# EAGLE design programer (EAGLE 5.06)

## Sheet 1 of 2
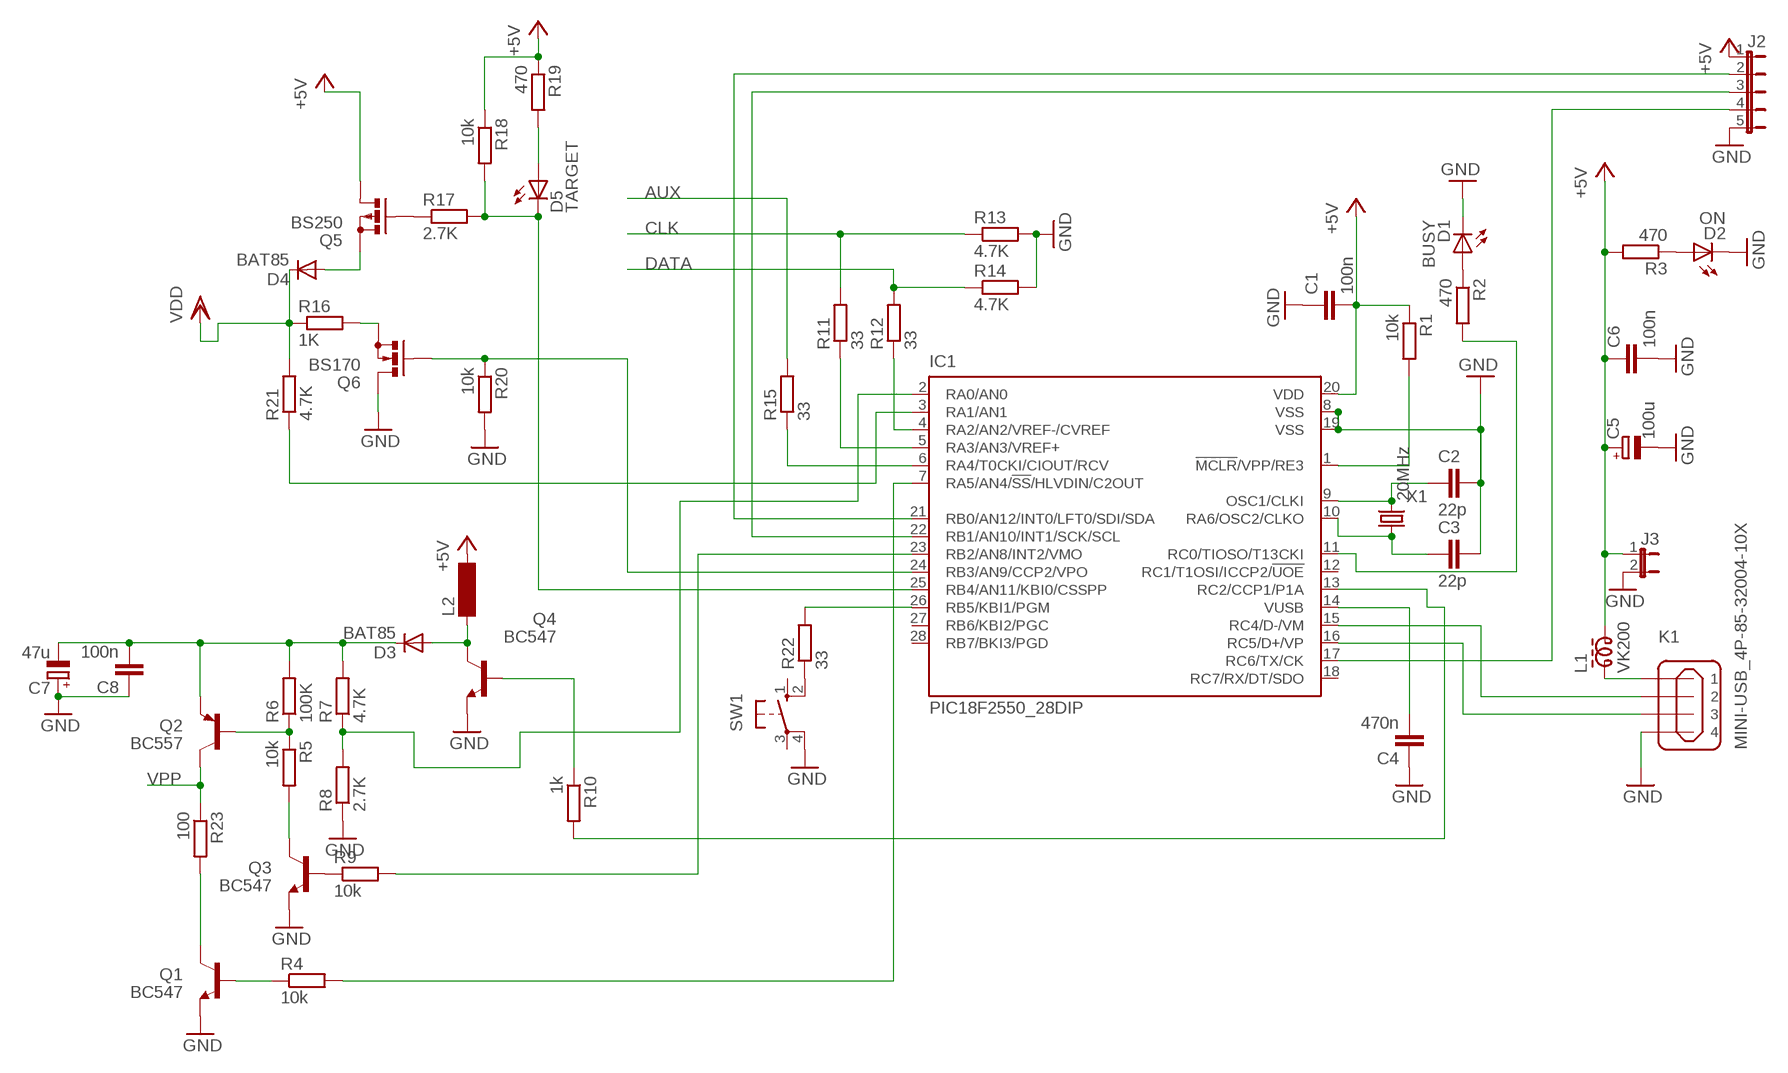
[diagram p0: schematic, sheet 1]

### Parts
C1  100n  C-EU025-025X050  [C025-025X050]
C2  22p  C-EU025-025X050  [C025-025X050]
C3  22p  C-EU025-025X050  [C025-025X050]
C4  470n  C-EU025-025X050  [C025-025X050]
C5  100u  CPOL-EUE2-4  [E2-4]
C6  100n  C-EU025-025X050  [C025-025X050]
C7  47u  CPOL-EUE2-4  [E2-4]
C8  100n  C-EU025-025X050  [C025-025X050]
D1  BUSY  LED3MM  [LED3MM]
D2  ON  LED3MM  [LED3MM]
D3  BAT85  BAT81  [DO34-7]
D4  BAT85  BAT81  [DO34-7]
D5  TARGET  LED3MM  [LED3MM]
IC1  PIC18F2550_28DIP  [DIL28-3]
J2  JP5L  [JP5L]
J3  JP1E  [JP1]
K1  MINI-USB_4P-85-32004-10X  [85-32004-10X]
L1  VK200  ZD60820511  [ZD6-2W]
L2  SD75  [SD75]
Q1  BC547  [TO92]
Q2  BC557  [TO92]
Q3  BC547  [TO92]
Q4  BC547  [TO92]
Q5  BS250  [SOT54E]
Q6  BS170  [SOT54E]
R1  10k  R-EU_0204/5  [0204/5]
R2  470  R-EU_0204/5  [0204/5]
R3  470  R-EU_0204/5  [0204/5]
R4  10k  R-EU_0204/5  [0204/5]
R5  10k  R-EU_0204/5  [0204/5]
R6  100K  R-EU_0204/5  [0204/5]
R7  4.7K  R-EU_0204/5  [0204/5]
R8  2.7K  R-EU_0204/5  [0204/5]
R9  10k  R-EU_0204/5  [0204/5]
R10  1k  R-EU_0204/5  [0204/5]
R11  33  R-EU_0204/5  [0204/5]
R12  33  R-EU_0204/5  [0204/5]
R13  4.7K  R-EU_0204/5  [0204/5]
R14  4.7K  R-EU_0204/5  [0204/5]
R15  33  R-EU_0204/5  [0204/5]
R16  1K  R-EU_0204/5  [0204/5]
R17  2.7K  R-EU_0204/5  [0204/5]
R18  10k  R-EU_0204/5  [0204/5]
R19  470  R-EU_0204/5  [0204/5]
R20  10k  R-EU_0204/5  [0204/5]
R21  4.7K  R-EU_0204/5  [0204/5]
R22  33  R-EU_0204/5  [0204/5]
R23  100  R-EU_0204/5  [0204/5]
SW1  10-XX  [B3F-10XX]
X1  20MHz  CRYSTALHC18U-V  [HC18U-V]

### Nets
+5V: C1.2 C5.+ C6.1 IC1.20(VDD) J2.1 J3.1 L1.2 L2.2 Q5.D R1.1 R3.2 R18.1 R19.1
AUX: R15.2 ; also sheet 2
CLK: R11.2 R13.1 ; also sheet 2
DATA: D5.K(C) IC1.25(RB4/AN11/KBI0/CSSPP) R12.2 R14.1 R17.2 R18.2 ; also sheet 2
GND: C1.1 C2.1 C3.1 C4.1 C5.- C6.2 C7.+ C8.1 D1.K(C) D2.K(C) IC1.8(VSS) IC1.19(VSS) J2.5 J3.2 K1.4 Q1.1(E) Q3.1(E) Q4.1(E) Q6.D R8.1 R13.2 R14.2 R20.2 SW1.4(P1) ; also sheet 2
K1: K1.1 L1.1
N$1: C4.2 IC1.14(VUSB)
N$2: D2.A R3.1
N$3: C2.2 IC1.9(OSC1/CLKI) X1.2
N$4: C3.2 IC1.10(RA6/OSC2/CLKO) X1.1
N$5: IC1.1(!MCLR!/VPP/RE3) R1.2
N$6: D1.A R2.1
N$7: IC1.11(RC0/TIOSO/T13CKI) R2.2
N$8: IC1.15(RC4/D-/VM) K1.2
N$9: IC1.16(RC5/D+/VP) K1.3
N$10: IC1.21(RB0/AN12/INT0/LFT0/SDI/SDA) J2.2
N$11: IC1.22(RB1/AN10/INT1/SCK/SCL) J2.3
N$12: IC1.17(RC6/TX/CK) J2.4
N$13: Q5.G R17.1
N$14: IC1.7(RA5/AN4/!SS!/HLVDIN/C2OUT) R4.2
N$15: Q4.2(B) R10.1
N$16: IC1.4(RA2/AN2/VREF-/CVREF) R12.1
N$17: IC1.5(RA3/AN3/VREF+) R11.1
N$18: IC1.6(RA4/T0CKI/CIOUT/RCV) R15.1
N$19: IC1.26(RB5/KBI1/PGM) R22.2
N$20: R22.1 SW1.2(S1)
N$21: IC1.13(RC2/CCP1/P1A) R10.2
N$22: D5.A R19.2
N$23: IC1.24(RB3/AN9/CCP2/VPO) Q6.G R20.1
N$24: Q6.S R16.2
N$25: D4.A Q5.S
N$26: IC1.3(RA1/AN1) R21.1
N$27: Q2.2(B) R5.1 R6.1
N$28: IC1.2(RA0/AN0) R7.1 R8.2
N$29: Q3.3(C) R5.2
N$30: D3.A L2.1 Q4.3(C)
N$31: C7.- C8.2 D3.C Q2.1(E) R6.2 R7.2
N$32: Q3.2(B) R9.1
N$33: Q1.2(B) R4.1
N$34: IC1.23(RB2/AN8/INT2/VMO) R9.2
N$35: Q1.3(C) R23.2
VDD: D4.C R16.1 R21.2 ; also sheet 2
VPP: Q2.3(C) R23.1 ; also sheet 2
Unconnected: IC1.12(RC1/T1OSI/ICCP2/!UOE) IC1.18(RC7/RX/DT/SDO) IC1.27(RB6/KBI2/PGC) IC1.28(RB7/BKI3/PGD) SW1.1(S) SW1.3(P)

## Sheet 2 of 2
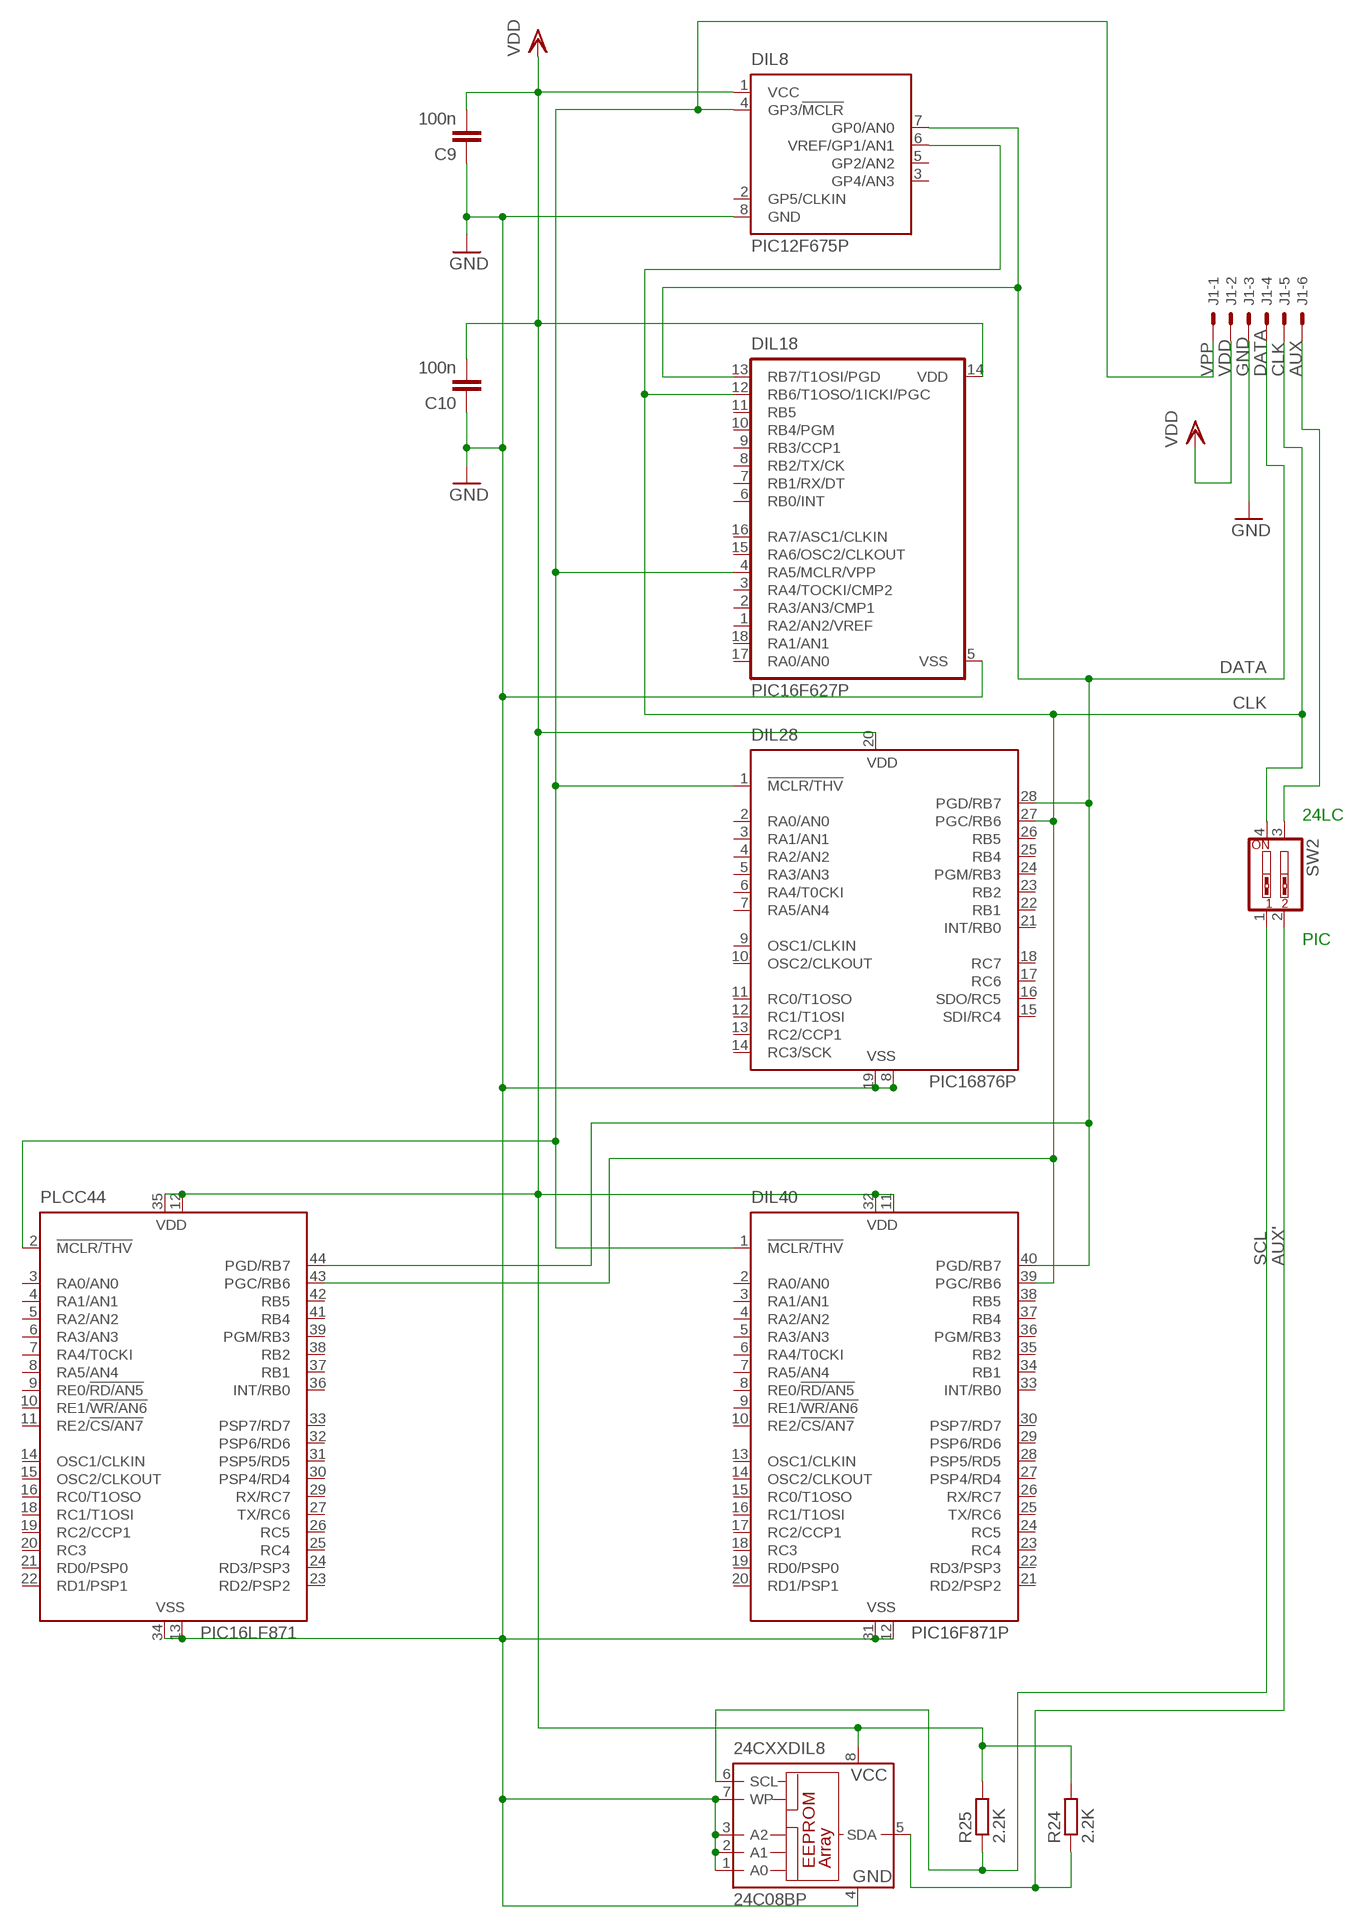
[diagram p1: schematic, sheet 2]

### Parts
24CXXDIL8  24C08BP  [DIL8]
C9  100n  C-EU025-025X050  [C025-025X050]
C10  100n  C-EU025-025X050  [C025-025X050]
DIL8  PIC12F675P  [DIL8]
DIL18  PIC16F627P  [DIL18]
DIL28  PIC16876P  [DIL28-3]
DIL40  PIC16F871P  [DIL40]
J1  22-23-2061  [22-23-2061]
PLCC44  PIC16LF871  [SOCKET44]
R24  2.2K  R-EU_0204/5  [0204/5]
R25  2.2K  R-EU_0204/5  [0204/5]
SW2  SW_DIP-2  [EDG-02]

### Nets
AUX: J1.6 SW2.3 ; also sheet 1
AUX': 24CXXDIL8.5(SDA) R24.1 SW2.2
CLK: DIL8.6(VREF/GP1/AN1) DIL18.12(RB6/T1OSO/1ICKI/PGC) DIL28.27(PGC/RB6) DIL40.39(PGC/RB6) J1.5 PLCC44.43(PGC/RB6) SW2.4 ; also sheet 1
DATA: DIL8.7(GP0/AN0) DIL18.13(RB7/T1OSI/PGD) DIL28.28(PGD/RB7) DIL40.40(PGD/RB7) J1.4 PLCC44.44(PGD/RB7) ; also sheet 1
GND: 24CXXDIL8.1(A0) 24CXXDIL8.2(A1) 24CXXDIL8.3(A2) 24CXXDIL8.4(GND) 24CXXDIL8.7(WP) C9.1 C10.1 DIL8.8(GND) DIL18.5(VSS) DIL28.8(VSS) DIL28.19(VSS) DIL40.12(VSS) DIL40.31(VSS) J1.3 PLCC44.13(VSS) PLCC44.34(VSS) ; also sheet 1
SCL: 24CXXDIL8.6(SCL) R25.1 SW2.1
VDD: 24CXXDIL8.8(VCC) C9.2 C10.2 DIL8.1(VCC) DIL18.14(VDD) DIL28.20(VDD) DIL40.11(VDD) DIL40.32(VDD) J1.2 PLCC44.12(VDD) PLCC44.35(VDD) R24.2 R25.2 ; also sheet 1
VPP: DIL8.4(GP3/!MCLR) DIL18.4(RA5/MCLR/VPP) DIL28.1(!MCLR/THV) DIL40.1(!MCLR/THV) J1.1 PLCC44.2(!MCLR/THV) ; also sheet 1
Unconnected: DIL8.2(GP5/CLKIN) DIL8.3(GP4/AN3) DIL8.5(GP2/AN2) DIL18.1(RA2/AN2/VREF) DIL18.2(RA3/AN3/CMP1) DIL18.3(RA4/TOCKI/CMP2) DIL18.6(RB0/INT) DIL18.7(RB1/RX/DT) DIL18.8(RB2/TX/CK) DIL18.9(RB3/CCP1) DIL18.10(RB4/PGM) DIL18.11(RB5) DIL18.15(RA6/OSC2/CLKOUT) DIL18.16(RA7/ASC1/CLKIN) DIL18.17(RA0/AN0) DIL18.18(RA1/AN1) DIL28.2(RA0/AN0) DIL28.3(RA1/AN1) DIL28.4(RA2/AN2) DIL28.5(RA3/AN3) DIL28.6(RA4/T0CKI) DIL28.7(RA5/AN4) DIL28.9(OSC1/CLKIN) DIL28.10(OSC2/CLKOUT) DIL28.11(RC0/T1OSO) DIL28.12(RC1/T1OSI) DIL28.13(RC2/CCP1) DIL28.14(RC3/SCK) DIL28.15(SDI/RC4) DIL28.16(SDO/RC5) DIL28.17(RC6) DIL28.18(RC7) DIL28.21(INT/RB0) DIL28.22(RB1) DIL28.23(RB2) DIL28.24(PGM/RB3) DIL28.25(RB4) DIL28.26(RB5) DIL40.2(RA0/AN0) DIL40.3(RA1/AN1) DIL40.4(RA2/AN2) DIL40.5(RA3/AN3) DIL40.6(RA4/T0CKI) DIL40.7(RA5/AN4) DIL40.8(RE0/!RD/AN5) DIL40.9(RE1/!WR/AN6) DIL40.10(RE2/!CS/AN7) DIL40.13(OSC1/CLKIN) DIL40.14(OSC2/CLKOUT) DIL40.15(RC0/T1OSO) DIL40.16(RC1/T1OSI) DIL40.17(RC2/CCP1) DIL40.18(RC3) DIL40.19(RD0/PSP0) DIL40.20(RD1/PSP1) DIL40.21(RD2/PSP2) DIL40.22(RD3/PSP3) DIL40.23(RC4) DIL40.24(RC5) DIL40.25(TX/RC6) DIL40.26(RX/RC7) DIL40.27(PSP4/RD4) DIL40.28(PSP5/RD5) DIL40.29(PSP6/RD6) DIL40.30(PSP7/RD7) DIL40.33(INT/RB0) DIL40.34(RB1) DIL40.35(RB2) DIL40.36(PGM/RB3) DIL40.37(RB4) DIL40.38(RB5) PLCC44.3(RA0/AN0) PLCC44.4(RA1/AN1) PLCC44.5(RA2/AN2) PLCC44.6(RA3/AN3) PLCC44.7(RA4/T0CKI) PLCC44.8(RA5/AN4) PLCC44.9(RE0/!RD/AN5) PLCC44.10(RE1/!WR/AN6) PLCC44.11(RE2/!CS/AN7) PLCC44.14(OSC1/CLKIN) PLCC44.15(OSC2/CLKOUT) PLCC44.16(RC0/T1OSO) PLCC44.18(RC1/T1OSI) PLCC44.19(RC2/CCP1) PLCC44.20(RC3) PLCC44.21(RD0/PSP0) PLCC44.22(RD1/PSP1) PLCC44.23(RD2/PSP2) PLCC44.24(RD3/PSP3) PLCC44.25(RC4) PLCC44.26(RC5) PLCC44.27(TX/RC6) PLCC44.29(RX/RC7) PLCC44.30(PSP4/RD4) PLCC44.31(PSP5/RD5) PLCC44.32(PSP6/RD6) PLCC44.33(PSP7/RD7) PLCC44.36(INT/RB0) PLCC44.37(RB1) PLCC44.38(RB2) PLCC44.39(PGM/RB3) PLCC44.41(RB4) PLCC44.42(RB5)

### Notes on the sheet
- 24LC
- PIC

## Library data of the parts
24CXXDIL8 = microchip-6:24*: Serial EEPROM I2C
C1-C4 C6 C8-C10 = rcl:C-EU: CAPACITOR, European symbol
C5 C7 = rcl:CPOL-EU: POLARIZED CAPACITOR, European symbol
D1 D2 D5 = led:LED: LED OSRAM: - CHIPLED LG R971, LG N971, LY N971, LG Q971, LY Q971, LO R971, LY R971 LH N974, LH R974 LS Q976, LO Q976, LY Q976 LO Q996 - Hyper CHIPLED LW Q18S LB Q993, LB Q99A, LB R99A - SideLED LS A670, LO A670, LY A670, LG A670, LP A670 LB A673, LV A673, LT A673, LW A673 LH A674 LY A675 LS A676, LA A676, LO A676, LY A676, LW A676 LS A679, LY A679, LG A679 - Hyper Micro SIDELED® LS Y876, LA Y876, LO Y876, LY Y876 LT Y87S - SmartLED LW L88C, LW L88S LB L89C, LB L89S, LG L890 LS L89K, LO L89K, LY L89K LS L896, LA L896, LO L896, LY L896 - TOPLED LS T670, LO T670, LY T670, LG T670, LP T670 LSG T670, LSP T670, LSY T670, LOP T670, LYG T670 LG T671, LOG T671, LSG T671 LB T673, LV T673, LT T673, LW T673 LH T674 LS T676, LA T676, LO T676, LY T676, LB T676, LH T676, LSB T676, LW T676 LB T67C, LV T67C, LT T67C, LS T67K, LO T67K, LY T67K, LW E67C LS E67B, LA E67B, LO E67B, LY E67B, LB E67C, LV E67C, LT E67C LW T67C LS T679, LY T679, LG T679 LS T770, LO T770, LY T770, LG T770, LP T770 LB T773, LV T773, LT T773, LW T773 LH T774 LS E675, LA E675, LY E675, LS T675 LS T776, LA T776, LO T776, LY T776, LB T776 LHGB T686 LT T68C, LB T68C - Hyper Mini TOPLED® LB M676 - Mini TOPLED Santana® LG M470 LS M47K, LO M47K, LY M47K Source: http://www.osram.convergy.de LUXEON: - LUMILED® LXK2-PW12-R00, LXK2-PW12-S00, LXK2-PW14-U00, LXK2-PW14-V00 LXK2-PM12-R00, LXK2-PM12-S00, LXK2-PM14-U00 LXK2-PE12-Q00, LXK2-PE12-R00, LXK2-PE12-S00, LXK2-PE14-T00, LXK2-PE14-U00 LXK2-PB12-K00, LXK2-PB12-L00, LXK2-PB12-M00, LXK2-PB14-N00, LXK2-PB14-P00, LXK2-PB14-Q00 LXK2-PR12-L00, LXK2-PR12-M00, LXK2-PR14-Q00, LXK2-PR14-R00 LXK2-PD12-Q00, LXK2-PD12-R00, LXK2-PD12-S00 LXK2-PH12-R00, LXK2-PH12-S00 LXK2-PL12-P00, LXK2-PL12-Q00, LXK2-PL12-R00 Source: www.luxeon.com KINGBRIGHT: KA-3528ASYC Source: www.kingbright.com
D3 D4 = diode:BAT81: DIODE barrier diode
DIL8 = microchip-6:PIC12F675: 8-Pin FLASH-Based 8-Bit CMOS Microcontroller Precision Internal 4 MHz oscillator factory calibrated to ±1% Low Power Features: Standby Current: - 1 nA @ 2.0V, typical Operating Current: - 8.5µA @ 32 kHz, 2.0V, typical - 100µA @ 1 MHz, 2.0V, typical Watchdog Timer Current: - 300 nA @ 2.0V, typical Timer1 oscillator current: - 4µA @ 32 kHz, 2.0V, typical Analog-to-Digital Converter module: - 10-bit resolution - Programmable 4-channel input - Voltage reference input Source: http://www.microchip.com .. 41190E.pdf
DIL18 = microchip-6:PIC16*F62: FLASH-Based 8-Bit CMOS Microcontroller Source: http://ww1.microchip.com/downloads/en/DeviceDoc/40300C.pdf
DIL28 = microchip-6:PIC16*876: MICROCONTROLLER flash type
DIL40 PLCC44 = microchip-6:PIC16*871: MICROCONTROLLER flash type
IC1 = microchip-6:PIC18F2*_28: USB Microcontrollers with nanoWatt Technology High-Performance, Enhanced Flash, 28/40/44-Pin, Source: http://ww1.microchip.com/downloads/en/devicedoc/39632c.pdf
J1 = con-molex:22-23-2061: .100" (2.54mm) Center Header - 6 Pin
J2 = jumper:JP5L
J3 = jumper:JP1E: JUMPER
K1 = con-cypressindustries:MINI-USB_4P-: MINI USB 4 Pol. Source: www.cypressindustries.com
L1 = inductor-neosid:ZD60820511: WIDE-BAND CHOKE 2 windings
L2 = inductor-neosid:SD75: INDUCTOR nominal inductance, E12
Q1 Q3 Q4 = transistor:BC547: NPN TRANSISTOR
Q2 = transistor-pnp:BC557: PNP Transistor
Q5 = transistor-small-signal:BS250: P-CHANNEL MOS FET
Q6 = transistor-small-signal:BS170: N-CHANNEL MOS FET
R1-R25 = rcl:R-EU_: RESISTOR, European symbol
SW1 = switch-omron:10-XX: OMRON SWITCH
SW2 = special:SW_DIP-2: DIP SWITCH
X1 = crystal:CRYSTAL: CRYSTAL

## Board
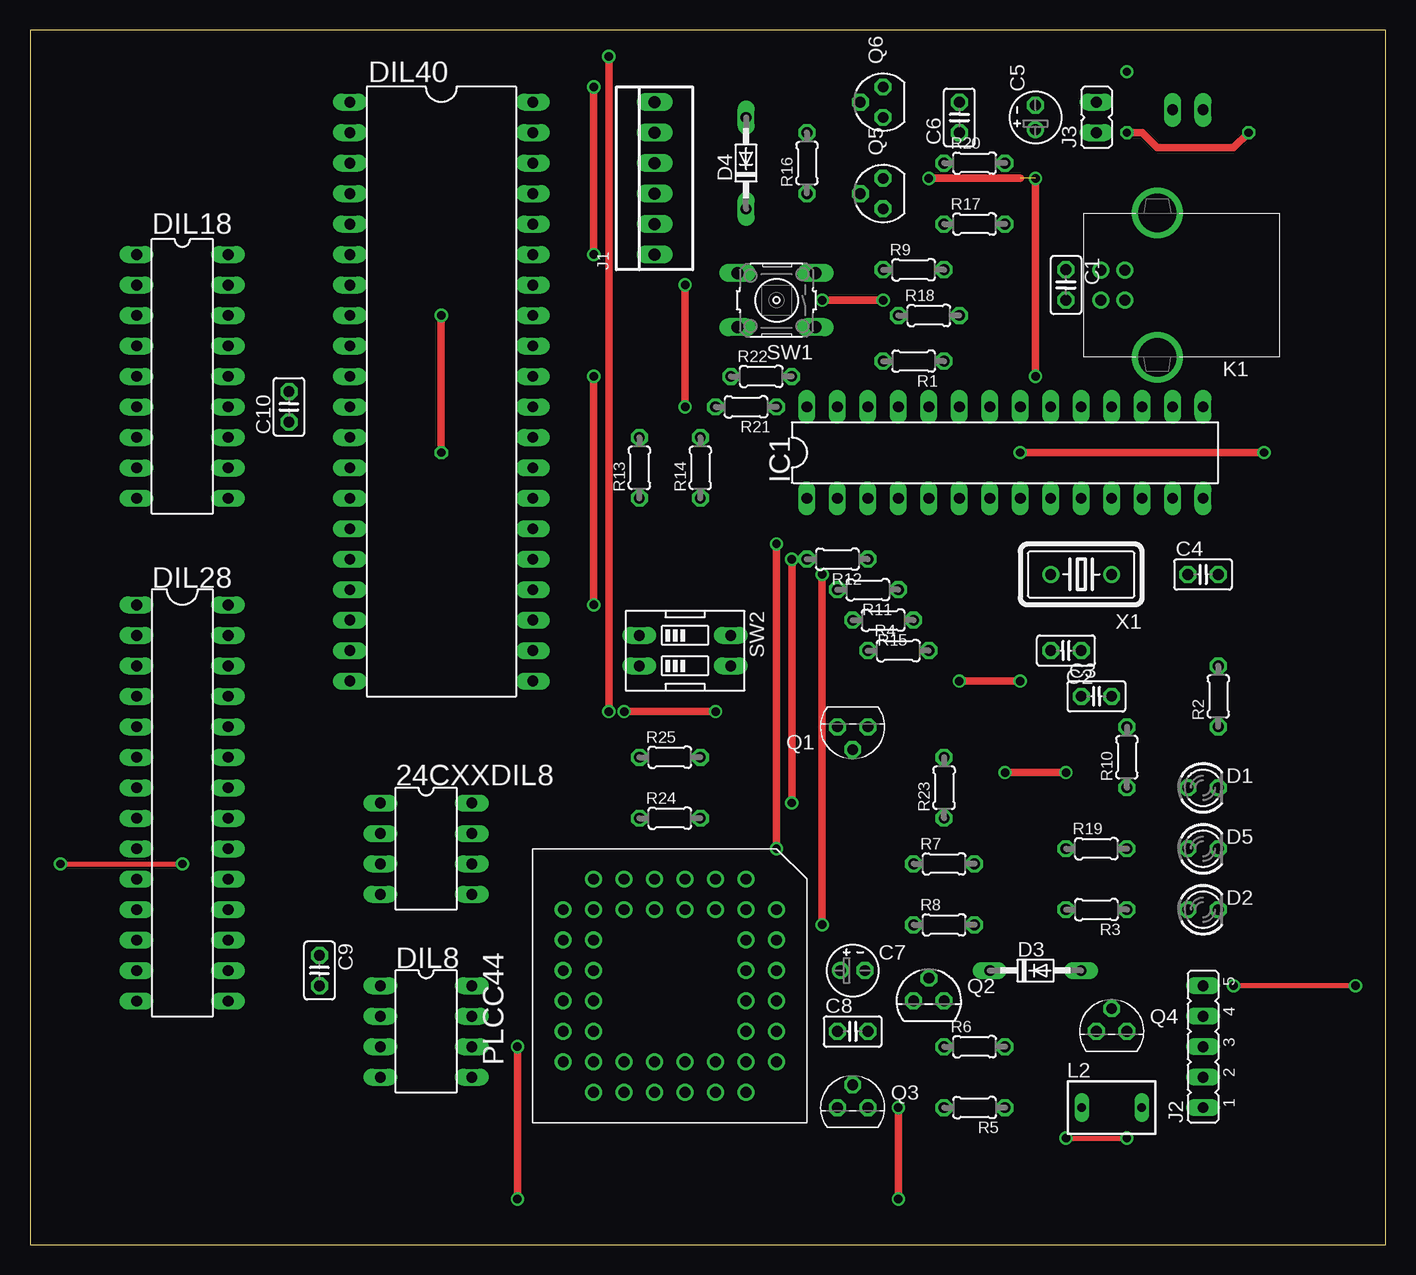
[diagram p2: board, top side]
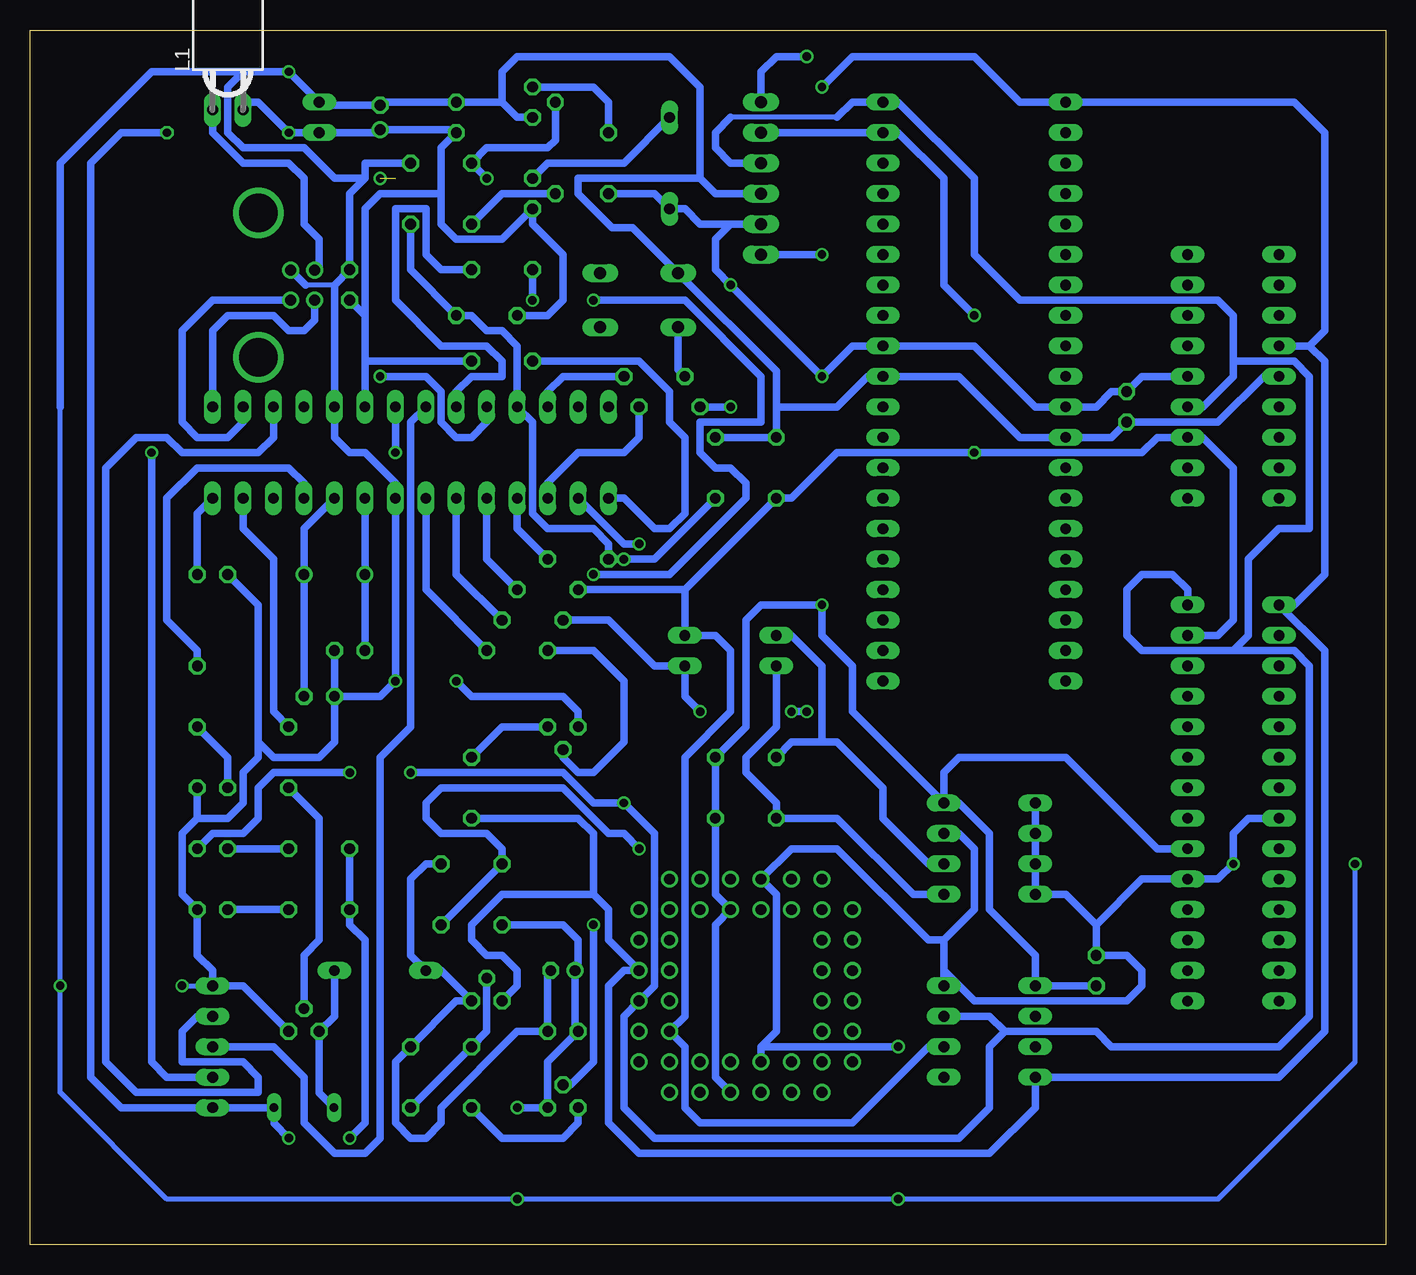
[diagram p3: board, bottom side, seen from below]

Size 113.01 x 101.27 mm. Coordinates in mm from the lower left corner, seen from the top.
Outline: 0,0 113.01,0 113.01,101.27 0,101.27 0,0
Copper layers (1*16): Top 0.035mm / dielectric 1.5mm / Bottom 0.035mm
Design rules "8mils": minimum track width 8mil, minimum drill 0.6mm, track to track 8mil, track to pad 8mil, pad to pad 8mil, via to via 8mil, smd to smd 8mil, copper to edge 40mil, drill to drill 10mil, minimum pad ring 10mil, minimum via ring 8mil, stop-mask expansion 0mil, vias tented up to drill 0mil, thermal gap 10mil

### Footprints (pad centres in the part's own frame; a part is rotated, then mirrored left to right if it is on the bottom)
DIL8 = drill 0.9 long: 1 -3.81,-3.81; 2 -1.27,-3.81; 3 1.27,-3.81; 4 3.81,-3.81; 5 3.81,3.81; 6 1.27,3.81; 7 -1.27,3.81; 8 -3.81,3.81
C025-025X050 = drill 0.9 octagon: 1 -1.27,0; 2 1.27,0
E2-4 = drill 0.9 pad 1.27 round: + -1.016,0 | drill 0.9 pad 1.27 octagon: - 1.016,0
LED3MM = drill 0.9 octagon: A -1.27,0; K 1.27,0
DO34-7 = drill 0.9 long: A 3.81,0; C -3.81,0
DIL18 = drill 0.9 long: 1 -10.16,-3.81; 2 -7.62,-3.81; 3 -5.08,-3.81; 4 -2.54,-3.81; 5 0,-3.81; 6 2.54,-3.81; 7 5.08,-3.81; 8 7.62,-3.81; 9 10.16,-3.81; 10 10.16,3.81; 11 7.62,3.81; 12 5.08,3.81; 13 2.54,3.81; 14 0,3.81; 15 -2.54,3.81; 16 -5.08,3.81; 17 -7.62,3.81; 18 -10.16,3.81
DIL28-3 = drill 0.9 long: 1 -16.51,-3.81; 2 -13.97,-3.81; 3 -11.43,-3.81; 4 -8.89,-3.81; 5 -6.35,-3.81; 6 -3.81,-3.81; 7 -1.27,-3.81; 8 1.27,-3.81; 9 3.81,-3.81; 10 6.35,-3.81; 11 8.89,-3.81; 12 11.43,-3.81; 13 13.97,-3.81; 14 16.51,-3.81; 15 16.51,3.81; 16 13.97,3.81; 17 11.43,3.81; 18 8.89,3.81; 19 6.35,3.81; 20 3.81,3.81; 21 1.27,3.81; 22 -1.27,3.81; 23 -3.81,3.81; 24 -6.35,3.81; 25 -8.89,3.81; 26 -11.43,3.81; 27 -13.97,3.81; 28 -16.51,3.81
DIL40 = drill 0.9 long: 1 -24.13,-7.62; 2 -21.59,-7.62; 3 -19.05,-7.62; 4 -16.51,-7.62; 5 -13.97,-7.62; 6 -11.43,-7.62; 7 -8.89,-7.62; 8 -6.35,-7.62; 9 -3.81,-7.62; 10 -1.27,-7.62; 11 1.27,-7.62; 12 3.81,-7.62; 13 6.35,-7.62; 14 8.89,-7.62; 15 11.43,-7.62; 16 13.97,-7.62; 17 16.51,-7.62; 18 19.05,-7.62; 19 21.59,-7.62; 20 24.13,-7.62; 21 24.13,7.62; 22 21.59,7.62; 23 19.05,7.62; 24 16.51,7.62; 25 13.97,7.62; 26 11.43,7.62; 27 8.89,7.62; 28 6.35,7.62; 29 3.81,7.62; 30 1.27,7.62; 31 -1.27,7.62; 32 -3.81,7.62; 33 -6.35,7.62; 34 -8.89,7.62; 35 -11.43,7.62; 36 -13.97,7.62; 37 -16.51,7.62; 38 -19.05,7.62; 39 -21.59,7.62; 40 -24.13,7.62
22-23-2061 = drill 1 long: 1 -6.35,0; 2 -3.81,0; 3 -1.27,0; 4 1.27,0; 5 3.81,0; 6 6.35,0
JP5L = drill 0.9 long: 1 1.27,1.27; 2 3.81,1.27; 3 6.35,1.27; 4 8.89,1.27; 5 11.43,1.27
JP1 = drill 0.9 long: 1 0,-1.27; 2 0,1.27
85-32004-10X = drill 0.9 pad 1.27 round: 1 4.71,-1.25; 2 4.71,1.25; 3 2.71,1.25; 4 2.71,-1.25 | drill 3.2 round: M1 0,6.02; M2 0,-6.02
ZD6-2W = drill 0.9 long: 1 -8.255,1.27; 2 -8.255,-1.27
SD75 = drill 0.7 long: 1 -2.5,0; 2 2.5,0
SOCKET44 = drill 0.9 round: 1 -2.54,0; 2 0,-2.54; 3 0,0; 4 2.54,-2.54; 5 2.54,0; 6 5.08,-2.54; 7 7.62,0; 8 5.08,0; 9 7.62,2.54; 10 5.08,2.54; 11 7.62,5.08; 12 5.08,5.08; 13 7.62,7.62; 14 5.08,7.62; 15 7.62,10.16; 16 5.08,10.16; 17 7.62,12.7; 18 5.08,15.24; 19 5.08,12.7; 20 2.54,15.24; 21 2.54,12.7; 22 0,15.24; 23 0,12.7; 24 -2.54,15.24; 25 -2.54,12.7; 26 -5.08,15.24; 27 -5.08,12.7; 28 -7.62,15.24; 29 -10.16,12.7; 30 -7.62,12.7; 31 -10.16,10.16; 32 -7.62,10.16; 33 -10.16,7.62; 34 -7.62,7.62; 35 -10.16,5.08; 36 -7.62,5.08; 37 -10.16,2.54; 38 -7.62,2.54; 39 -10.16,0; 40 -7.62,-2.54; 41 -7.62,0; 42 -5.08,-2.54; 43 -5.08,0; 44 -2.54,-2.54
TO92 = drill 0.9 octagon: 1 1.27,0; 2 0,1.905; 3 -1.27,0
SOT54E = drill 0.9 octagon: D -1.27,0; G 0,1.905; S 1.27,0
0204/5 = drill 0.9 octagon: 1 -2.54,0; 2 2.54,0
B3F-10XX = drill 1 long: 1 -3.251,2.261; 2 3.251,2.261; 3 -3.251,-2.261; 4 3.251,-2.261
EDG-02 = drill 0.9 long: 1 -1.27,-3.81; 2 1.27,-3.81; 3 1.27,3.81; 4 -1.27,3.81
HC18U-V = drill 0.9 round: 1 -2.54,0; 2 2.54,0

### Placement (x,y rotation side)
24CXXDIL8  33.02,33.02 270 top
C1  86.36,80.01 270 top
C2  86.36,49.53 180 top
C3  88.9,45.72 0 top
C4  97.79,55.88 0 top
C5  83.82,93.98 90 top
C6  77.47,93.98 90 top
C7  68.58,22.86 0 top
C8  68.58,17.78 0 top
C9  24.13,22.86 270 top
C10  21.59,69.85 90 top
D1  97.79,38.1 0 top
D2  97.79,27.94 0 top
D3  83.82,22.86 0 top
D4  59.69,90.17 90 top
D5  97.79,33.02 0 top
DIL8  33.02,17.78 270 top
DIL18  12.7,72.39 270 top
DIL28  12.7,36.83 270 top
DIL40  34.29,71.12 270 top
IC1  81.28,66.04 0 top
J1  52.07,88.9 90 top
J2  99.06,10.16 90 top
J3  88.9,93.98 0 top
K1  93.98,80.01 180 top
L1  96.52,102.87 90 bottom
L2  90.17,11.43 0 top
PLCC44  59.69,22.86 90 top
Q1  68.58,43.18 180 top
Q2  74.93,20.32 0 top
Q3  68.58,11.43 0 top
Q4  90.17,17.78 0 top
Q5  71.12,87.63 90 top
Q6  71.12,95.25 90 top
R1  73.66,73.66 180 top
R2  99.06,45.72 90 top
R3  88.9,27.94 180 top
R4  72.39,49.53 0 top
R5  78.74,11.43 180 top
R6  78.74,16.51 0 top
R7  76.2,31.75 0 top
R8  76.2,26.67 0 top
R9  73.66,81.28 0 top
R10  91.44,40.64 90 top
R11  69.85,54.61 180 top
R12  67.31,57.15 180 top
R13  50.8,64.77 90 top
R14  55.88,64.77 90 top
R15  71.12,52.07 180 top
R16  64.77,90.17 90 top
R17  78.74,85.09 0 top
R18  74.93,77.47 0 top
R19  88.9,33.02 0 top
R20  78.74,90.17 0 top
R21  59.69,69.85 180 top
R22  60.96,72.39 0 top
R23  76.2,38.1 90 top
R24  53.34,35.56 0 top
R25  53.34,40.64 0 top
SW1  62.23,78.74 180 top
SW2  54.61,49.53 270 top
X1  87.63,55.88 180 top

### Tracks (layer width: path | path; a pad name or v marks a point on that pad's centre or on a via)
+5V  (via drill 0.7)
  Top 0.406: v86.36,8.89 v91.44,8.89
  Top 0.61: v91.44,92.71 92.71,92.71 93.98,91.44 100.33,91.44 v101.6,92.71
  Bottom 0.61: L1.2 94.61,95.25 93.98,95.25 v91.44,92.71 J3.1 84.07,92.71 C5.+ 77.72,92.96 C6.1 78.74,91.44 78.74,87.63 | 85.09,73.66 IC1.20 85.09,86.36 83.82,87.63 78.74,87.63 | 85.09,73.66 R1.1 | R18.1 69.85,77.47 68.58,78.74 68.58,82.55 71.12,85.09 Q5.D 73.66,83.82 77.47,83.82 78.74,85.09 78.74,87.63 | R19.1 R3.2 86.36,26.67 85.09,25.4 85.09,10.16 v86.36,8.89 | v91.44,8.89 92.67,10.12 L2.2 J2.1 105.41,11.43 107.95,13.97 107.95,90.17 105.41,92.71 v101.6,92.71 | 85.09,73.66 85.09,77.47 C1.2
AUX  (via drill 0.7)
  Top 0.61: v48.26,44.45 v48.26,99.06 | v49.53,44.45 v57.15,44.45
  Bottom 0.61: R15.2 64.77,52.07 60.96,48.26 SW2.3 58.42,45.72 v57.15,44.45 | v48.26,99.06 50.8,99.06 52.07,97.79 J1.6 | v49.53,44.45 v48.26,44.45
AUX'
  Bottom 0.61: 24CXXDIL8.5 39.37,29.21 45.72,35.56 R24.1 50.8,36.83 53.34,39.37 53.34,40.64 50.8,43.18 SW2.2
CLK  (via drill 0.7)
  Top 0.61: v34.29,66.04 v34.29,77.47
  Bottom 0.406: J1.5 DIL40.39
  Bottom 0.61: DIL28.27 13.97,50.8 12.7,52.07 12.7,64.77 15.24,67.31 DIL18.12 19.05,67.31 20.32,66.04 v34.29,66.04 45.72,66.04 49.53,62.23 R13.1 58.42,54.61 | 58.42,54.61 SW2.4 55.88,50.8 54.61,49.53 54.61,44.45 58.42,40.64 58.42,19.05 PLCC44.43 58.42,16.51 58.42,11.43 57.15,10.16 44.45,10.16 38.1,16.51 DIL8.6 | 58.42,54.61 R11.2 | J1.5 40.64,92.71 36.83,88.9 36.83,80.01 v34.29,77.47
DATA  (via drill 0.7)
  Top 0.61: v63.5,36.83 v63.5,57.15 | v81.28,39.37 v86.36,39.37
  Bottom 0.406: 45.72,93.98 54.61,93.98
  Bottom 0.61: 12.7,73.66 12.7,72.39 15.24,69.85 DIL18.13 | 12.7,73.66 12.7,77.47 13.97,78.74 30.48,78.74 34.29,82.55 34.29,88.9 40.64,95.25 DIL40.40 44.45,95.25 45.72,93.98 | DIL28.28 16.51,54.61 17.78,55.88 20.32,55.88 21.59,54.61 21.59,50.8 20.32,49.53 13.97,49.53 | 13.97,49.53 12.7,49.53 11.43,50.8 11.43,57.15 8.89,59.69 6.35,59.69 6.35,72.39 7.62,73.66 12.7,73.66 | DIL8.7 33.02,19.05 31.75,17.78 | 31.75,17.78 24.13,17.78 22.86,16.51 8.89,16.51 6.35,19.05 6.35,48.26 7.62,49.53 13.97,49.53 | R14.1 60.96,57.15 v63.5,57.15 R12.2 64.77,58.42 66.04,59.69 69.85,59.69 71.12,60.96 71.12,68.58 IC1.25 72.39,74.93 73.66,76.2 74.93,76.2 76.2,77.47 R18.2 81.28,81.28 R17.2 | 63.5,19.05 PLCC44.44 | 63.5,19.05 63.5,11.43 60.96,8.89 35.56,8.89 33.02,11.43 33.02,16.51 31.75,17.78 | 54.61,93.98 55.88,92.71 55.88,91.44 54.61,90.17 J1.4 | 63.5,19.05 60.96,21.59 60.96,34.29 v63.5,36.83 66.04,36.83 68.58,39.37 v81.28,39.37 | D5.K 97.79,34.29 95.25,34.29 93.98,35.56 93.98,38.1 92.71,39.37 v86.36,39.37
GND  (via drill 0.7)
  Top 0.406: v2.54,31.75 v12.7,31.75 | v110.49,21.59 v100.33,21.59
  Top 0.61: v40.64,3.81 v40.64,16.51 | v72.39,3.81 v72.39,11.43 | v82.55,46.99 v77.47,46.99
  Bottom 0.406: 87.63,80.01 90.02,80.01 | v2.54,31.75 2.54,15.24 13.97,3.81 v40.64,3.81 v72.39,3.81 101.6,3.81 110.49,12.7 v110.49,21.59 110.49,69.85 | v100.33,21.59 J2.5
  Bottom 0.61: DIL28.8 11.43,35.56 12.7,34.29 v12.7,31.75 13.97,30.48 DIL28.19 20.32,30.48 24.13,26.67 | DIL18.5 10.16,72.39 13.97,68.58 C10.1 22.86,67.31 DIL40.12 30.48,67.31 35.56,72.39 DIL40.31 43.18,72.39 45.72,69.85 50.8,69.85 | 24.13,26.67 C9.1 21.59,24.13 20.32,22.86 20.32,21.59 21.59,20.32 34.29,20.32 36.83,22.86 36.83,25.4 | 24.13,26.67 26.67,29.21 24CXXDIL8.4 24CXXDIL8.3 24CXXDIL8.2 24CXXDIL8.1 | 36.83,25.4 DIL8.8 | 36.83,25.4 34.29,27.94 34.29,33.02 35.56,34.29 24CXXDIL8.7 | C3.1 C2.1 | 99.06,35.56 D1.K | 99.06,35.56 100.33,34.29 100.33,29.21 D2.K 99.06,24.13 97.79,22.86 J2.5 95.25,21.59 Q4.1 | 57.15,88.9 67.31,88.9 67.31,87.63 64.49,84.81 62.79,84.81 SW1.4 50.8,72.82 50.8,69.85 | 57.15,88.9 55.88,87.63 J1.3 | R14.2 R13.2 50.8,69.85 | 36.83,25.4 38.1,25.4 45.72,33.02 49.53,33.02 PLCC44.13 50.8,29.21 50.8,17.78 52.07,16.51 | 52.07,16.51 PLCC44.34 | C4.1 93.98,53.34 93.98,41.91 | 93.98,41.91 92.71,40.64 88.9,40.64 87.63,41.91 C3.1 | 90.02,80.01 K1.4 | 85.09,88.9 87.63,88.9 90.17,91.44 95.25,91.44 96.52,92.71 96.52,96.52 95.25,97.79 v91.44,97.79 | v91.44,97.79 J3.2 88.65,95 C5.- 83.57,95.25 C6.2 73.66,95.25 | 85.09,88.9 86.36,87.63 C1.1 87.63,80.01 IC1.19 87.63,67.31 86.36,66.04 85.09,66.04 82.55,63.5 IC1.8 v82.55,46.99 83.82,45.72 C3.1 | Q6.D 72.39,93.98 73.66,95.25 | 73.66,95.25 73.66,97.79 72.39,99.06 59.69,99.06 57.15,96.52 57.15,88.9 | R8.1 68.58,26.67 67.31,25.4 67.31,23.11 C7.+ 67.56,18.03 C8.1 69.85,15.24 Q3.1 v72.39,11.43 | Q1.1 67.31,44.45 68.58,45.72 76.2,45.72 v77.47,46.99 | R20.2 85.09,90.17 85.09,88.9 | 93.98,41.91 93.98,40.64 95.25,39.37 95.25,36.83 96.52,35.56 99.06,35.56
  Bottom 0.61: v40.64,16.51 52.07,16.51 | v91.44,97.79 102.87,97.79 110.49,90.17 110.49,69.85
K1
  Bottom 0.61: L1.1 97.79,92.71 95.25,90.17 91.44,90.17 90.17,88.9 90.17,85.09 88.9,83.82 88.9,81.63 K1.1
N$1
  Bottom 0.61: C4.2 99.06,60.96 IC1.14
N$2
  Bottom 0.61: R3.1 D2.A
N$3
  Bottom 0.61: IC1.9 X1.2 C2.2
N$4
  Bottom 0.61: IC1.10 90.17,59.69 X1.1 C3.2
N$5
  Bottom 0.61: IC1.1 63.5,62.23 60.96,59.69 59.69,59.69 58.42,60.96 58.42,67.31 59.69,68.58 59.69,71.12 62.23,73.66 R1.2
N$6
  Bottom 0.61: D1.A 96.52,40.64 R2.1
N$7
  Bottom 0.61: R2.2 99.06,49.53 101.6,52.07 101.6,62.23 99.06,64.77 91.44,64.77 90.17,63.5 IC1.11
N$8
  Bottom 0.61: K1.2 89.27,77.1 90.17,76.2 91.44,76.2 92.71,77.47 96.52,77.47 97.79,76.2 IC1.15
N$9
  Bottom 0.61: K1.3 97.77,78.76 100.33,76.2 100.33,68.58 99.06,67.31 96.52,67.31 95.25,68.58 IC1.16
N$10  (via drill 0.7)
  Top 0.61: v102.87,66.04 v82.55,66.04
  Bottom 0.61: J2.2 101.6,13.97 102.87,15.24 v102.87,66.04 | v82.55,66.04 IC1.21
N$11
  Bottom 0.61: J2.3 92.71,16.51 90.17,13.97 90.17,10.16 87.63,7.62 85.09,7.62 83.82,8.89 83.82,40.64 81.28,43.18 81.28,68.58 IC1.22
N$12
  Bottom 0.61: J2.4 99.06,19.05 100.33,17.78 100.33,15.24 95.25,15.24 93.98,13.97 93.98,12.7 104.14,12.7 106.68,15.24 106.68,64.77 104.14,67.31 101.6,67.31 100.33,66.04 93.98,66.04 92.71,67.31 IC1.17
N$13
  Bottom 0.61: Q5.G 73.66,87.63 R17.1
N$14
  Bottom 0.61: IC1.7 80.01,54.61 R4.2
N$15
  Bottom 0.61: Q4.2 90.17,24.13 88.9,25.4 88.9,35.56 R10.1
N$16
  Bottom 0.61: IC1.4 72.39,59.69 R12.1
N$17
  Bottom 0.61: IC1.5 74.93,57.15 R11.1
N$18
  Bottom 0.61: IC1.6 77.47,55.88 R15.1
N$19
  Bottom 0.61: R22.2 68.58,72.39 69.85,71.12 IC1.26
N$20
  Bottom 0.61: R22.1 58.98,72.95 SW1.2
N$21
  Bottom 0.61: R10.2 92.71,44.45 92.71,57.15 95.25,59.69 IC1.13
N$22
  Bottom 0.61: R19.2 D5.A
N$23  (via drill 0.7)  (1 unrouted)
  Top 0.61: v83.82,72.39 v83.82,88.9 | v74.93,88.9 82.55,88.9
  Bottom 0.61: Q6.G 69.22,92.08 69.85,91.44 74.93,91.44 R20.1 v74.93,88.9 | v83.82,72.39 80.01,72.39 78.74,71.12 78.74,68.58 77.47,67.31 76.2,67.31 74.93,68.58 IC1.24
N$24
  Bottom 0.61: Q6.S 66.04,96.52 64.77,95.25 R16.2
N$25
  Bottom 0.61: D4.A 63.5,90.17 69.85,90.17 Q5.S
N$26
  Bottom 0.61: IC1.3 69.85,63.5 67.31,66.04 63.5,66.04 62.23,67.31 R21.1
N$27
  Bottom 0.61: R5.1 R6.1 74.93,17.78 Q2.2
N$28  (via drill 0.7)
  Top 0.61: v62.23,33.02 v62.23,58.42
  Bottom 0.61: R8.2 R7.1 73.66,33.02 74.93,34.29 78.74,34.29 80.01,35.56 80.01,36.83 78.74,38.1 68.58,38.1 64.77,34.29 63.5,34.29 v62.23,33.02 | v62.23,58.42 63.5,58.42 IC1.2
N$29
  Bottom 0.61: R5.2 73.66,8.89 68.58,8.89 67.31,10.16 Q3.3
N$30
  Bottom 0.61: L2.1 88.9,12.66 Q4.3 87.63,19.05 D3.A
N$31
  Bottom 0.61: R7.2 80.01,31.75 81.28,30.48 81.28,24.13 D3.C 78.74,22.86 Q2.1 77.47,20.32 R6.2 82.55,15.24 82.55,10.16 81.28,8.89 80.01,8.89 78.74,10.16 78.74,11.43 72.39,17.78 C8.2 69.85,22.61 C7.-
N$32  (via drill 0.7)
  Top 0.61: v66.04,26.67 v66.04,55.88 | v66.04,78.74 v71.12,78.74
  Bottom 0.61: Q3.2 67.94,13.34 66.04,15.24 v66.04,26.67 | v66.04,55.88 59.69,55.88 53.34,62.23 53.34,63.5 54.61,64.77 55.88,64.77 57.15,66.04 57.15,68.58 52.07,68.58 52.07,72.39 58.42,78.74 v66.04,78.74 | v71.12,78.74 R9.1
N$33
  Bottom 0.61: R4.1 66.04,49.53 63.5,46.99 63.5,41.91 66.04,39.37 67.31,39.37 68.58,40.64 Q1.2
N$34
  Bottom 0.61: IC1.23 77.47,71.12 76.2,72.39 73.66,72.39 73.66,73.66 74.93,74.93 78.74,74.93 82.55,78.74 82.55,86.36 80.01,86.36 80.01,82.55 78.74,81.28 R9.2
N$35
  Bottom 0.61: Q1.3 73.66,43.18 R23.2
SCL
  Bottom 0.61: 24CXXDIL8.6 38.1,31.75 41.91,35.56 41.91,38.1 45.72,41.91 46.99,41.91 | 46.99,41.91 49.53,41.91 R25.1 | SW2.1 49.53,50.8 46.99,48.26 46.99,41.91
VDD  (via drill 0.7)
  Top 0.61: v46.99,53.34 v46.99,72.39 | v54.61,80.01 v54.61,69.85
  Bottom 0.61: DIL18.14 20.32,72.39 C10.2 22.86,71.12 24.13,69.85 DIL40.11 29.21,69.85 34.29,74.93 DIL40.32 44.45,74.93 v46.99,72.39 v54.61,80.01 55.88,81.28 55.88,83.82 54.61,85.09 J1.2 57.15,85.09 58.42,86.36 D4.C 60.96,87.63 R16.1 | C9.2 DIL8.1 29.21,24.13 33.02,27.94 33.02,34.29 35.56,36.83 24CXXDIL8.8 | DIL28.20 19.05,33.02 26.67,40.64 35.56,40.64 36.83,39.37 24CXXDIL8.8 | 24CXXDIL8.8 44.45,44.45 44.45,48.26 46.99,50.8 v46.99,53.34 52.07,53.34 53.34,52.07 53.34,43.18 R25.2 R24.2 55.88,29.21 PLCC44.12 55.88,26.67 55.88,13.97 PLCC44.35 | v54.61,69.85 R21.2
VPP  (via drill 0.7)
  Top 0.61: v46.99,96.52 v46.99,82.55
  Bottom 0.61: 6.35,74.93 5.08,73.66 5.08,55.88 7.62,53.34 DIL28.1 5.08,49.53 5.08,17.78 8.89,13.97 DIL8.4 29.21,11.43 33.02,7.62 62.23,7.62 64.77,10.16 64.77,21.59 63.5,22.86 PLCC44.2 64.77,25.4 64.77,27.94 66.04,29.21 | 6.35,74.93 DIL18.4 | 6.35,74.93 5.08,76.2 5.08,92.71 7.62,95.25 DIL40.1 30.48,95.25 34.29,99.06 44.45,99.06 v46.99,96.52 | Q2.3 72.39,21.59 72.39,22.86 73.66,24.13 74.93,24.13 76.2,25.4 76.2,26.67 73.66,29.21 66.04,29.21 | R23.1 67.31,35.56 66.04,34.29 66.04,29.21 | v46.99,82.55 J1.1